# EAGLE design DMTV_v2 (EAGLE 9.6.2)
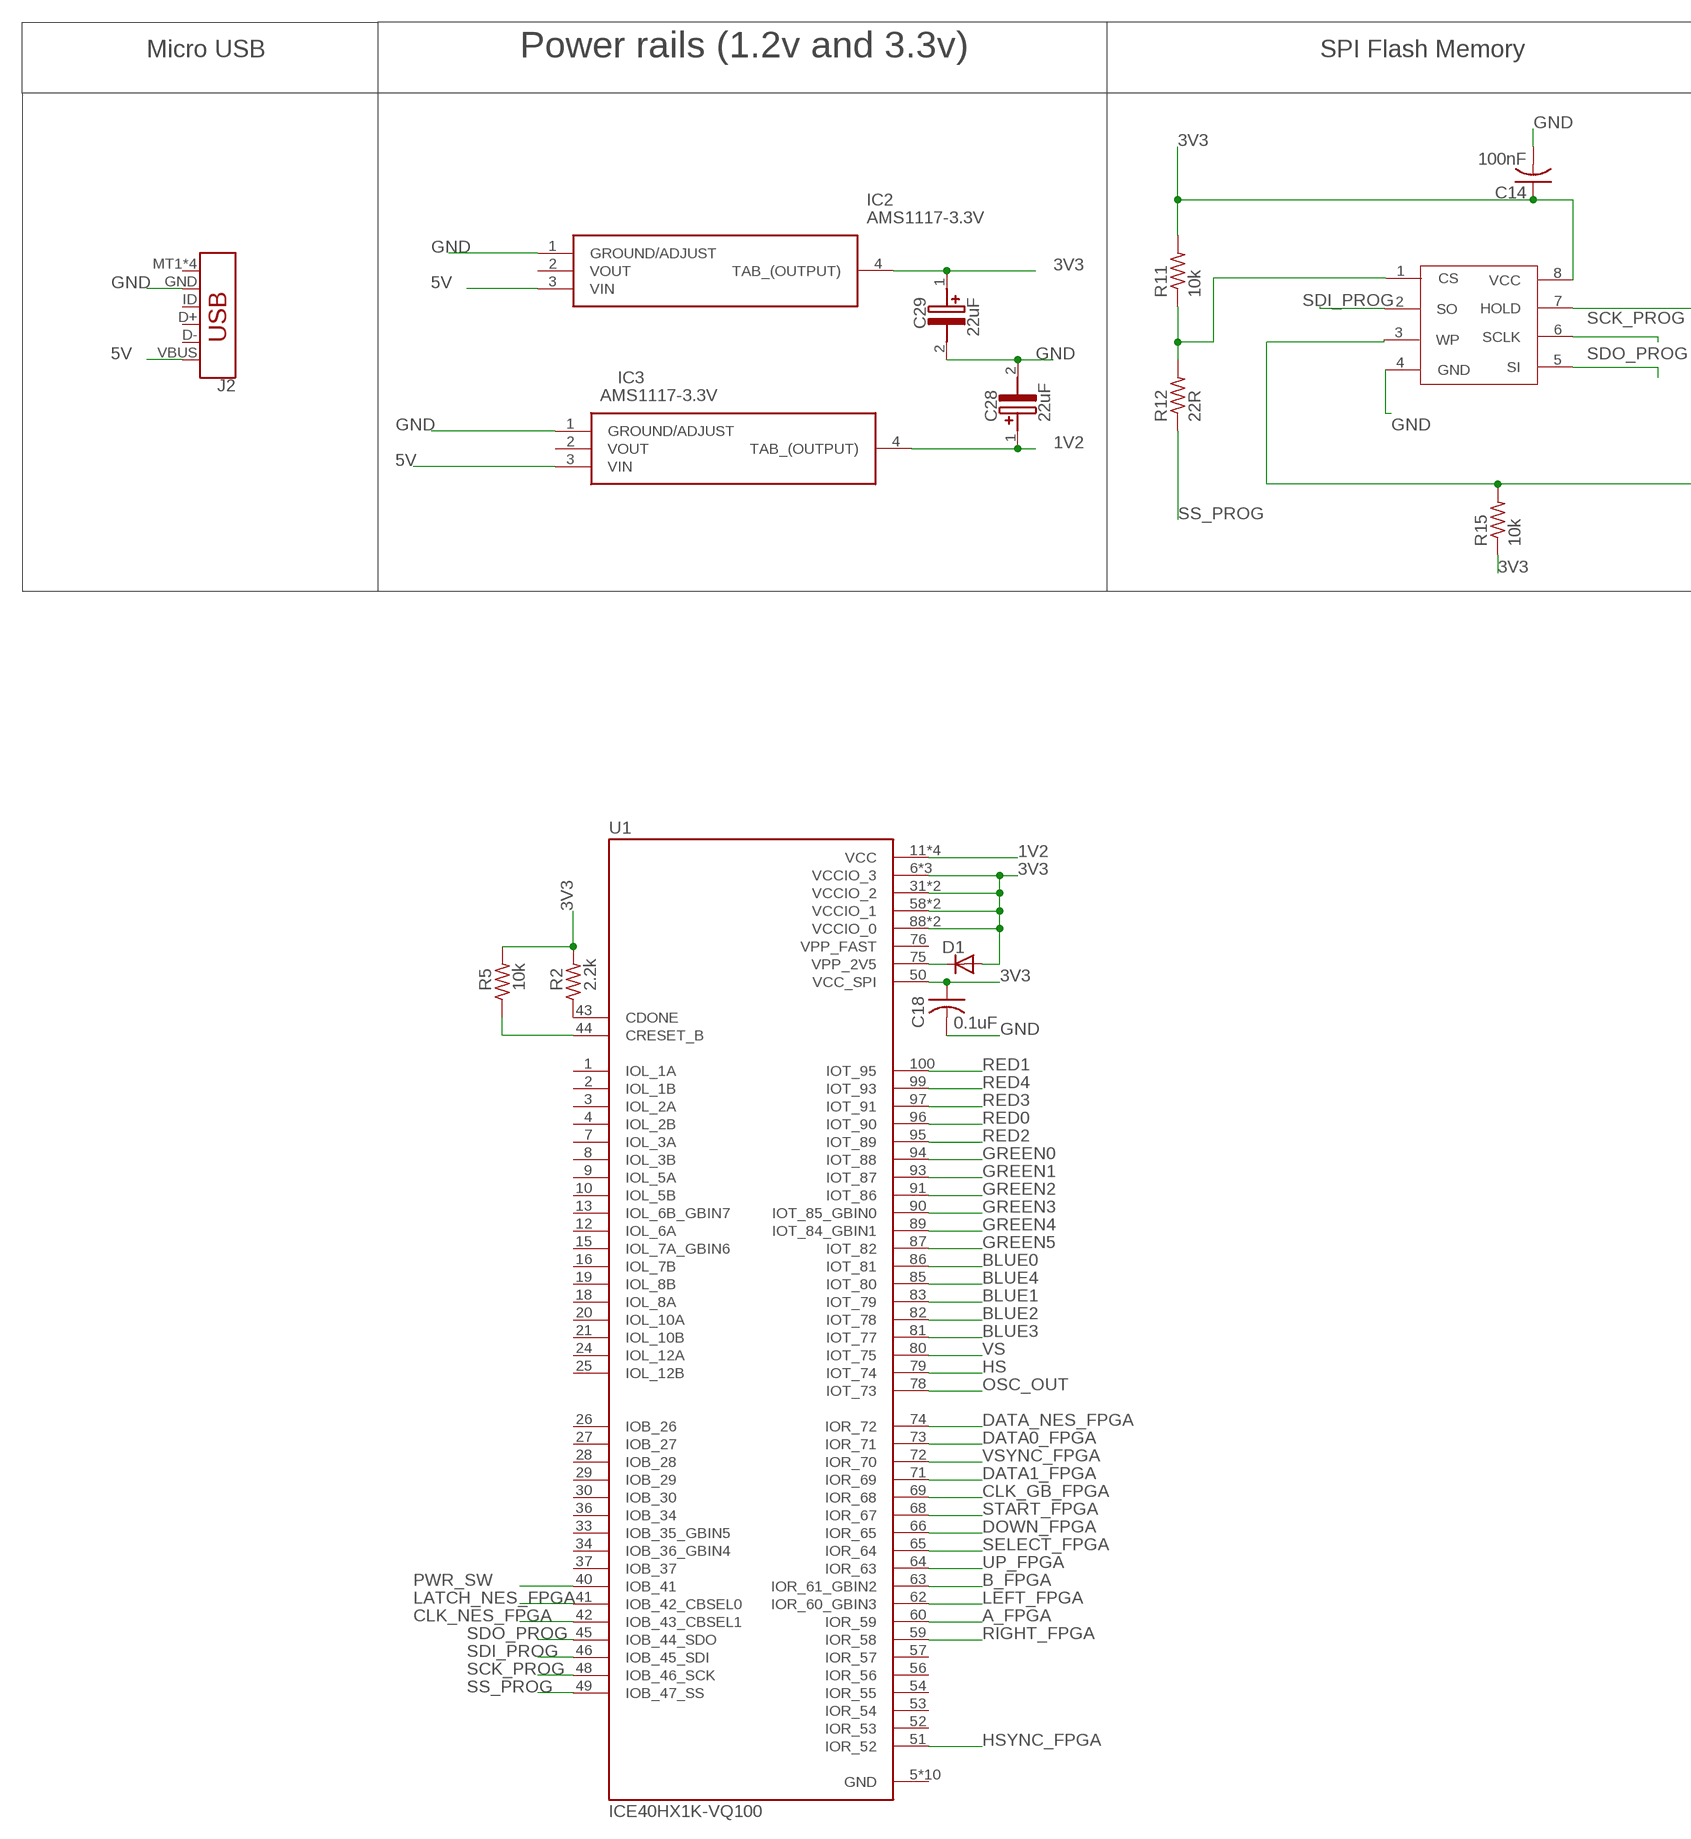
[diagram p0: schematic, sheet 1, part 1 of 2]
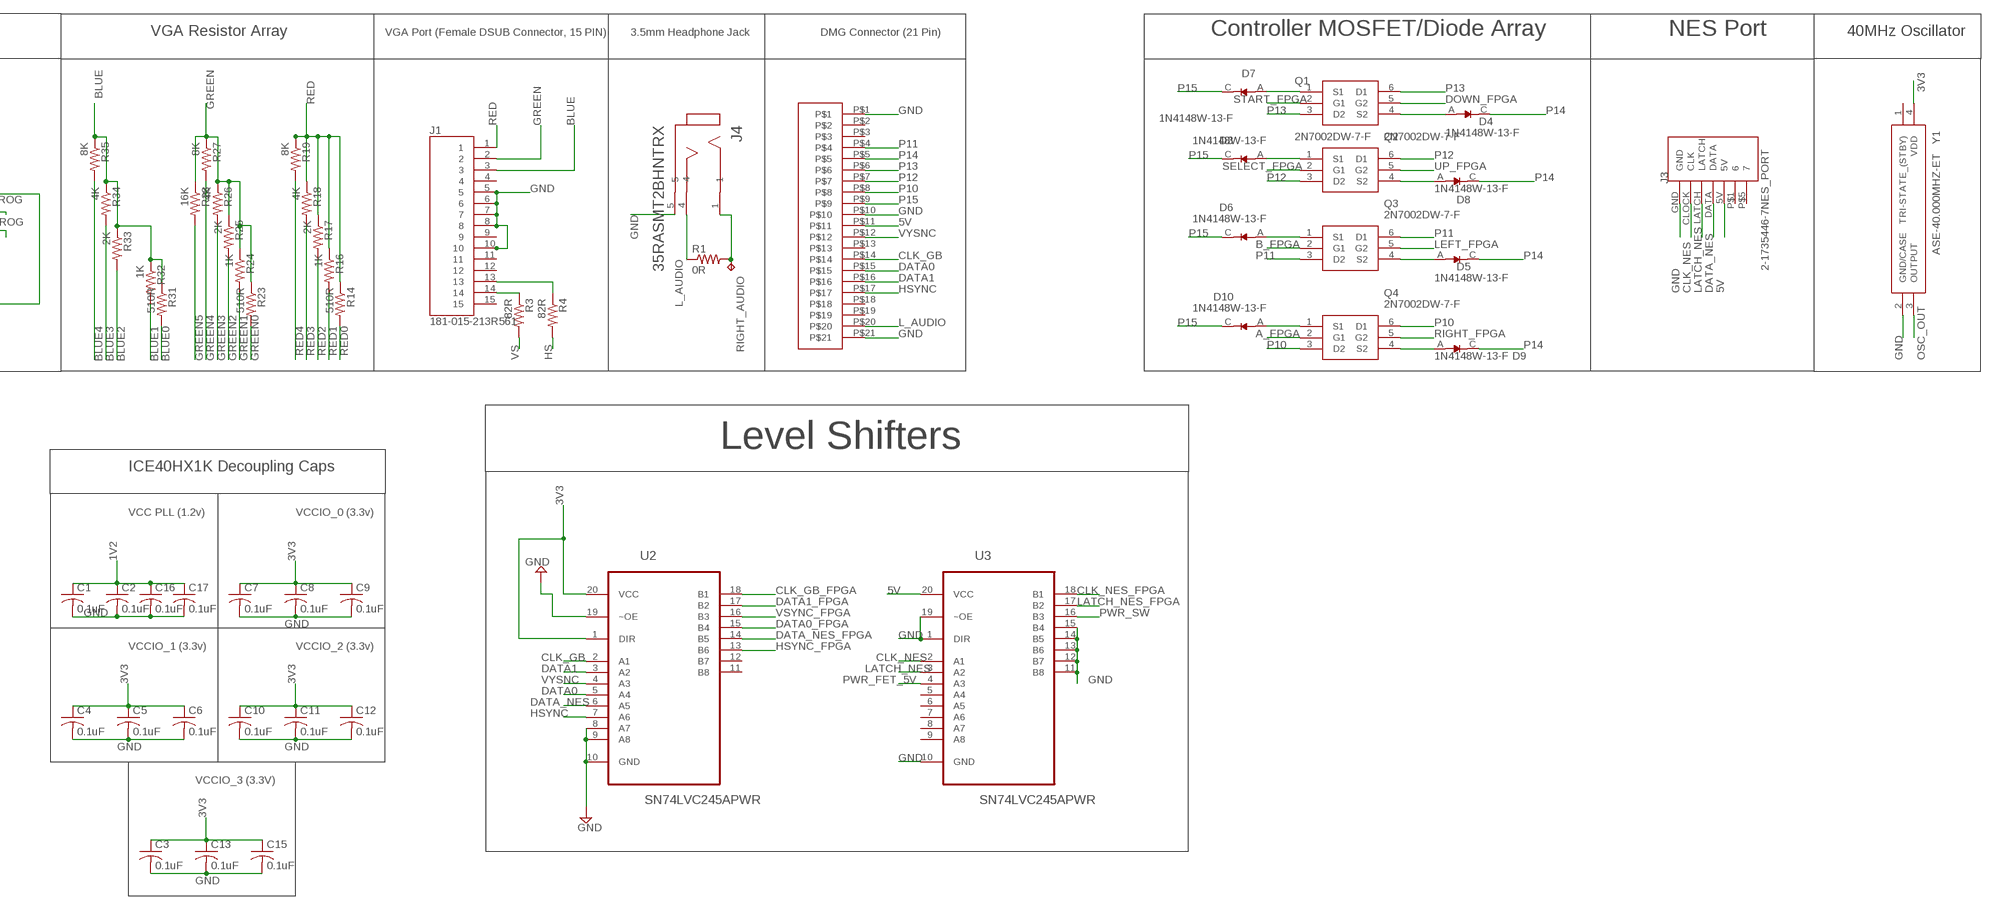
[diagram p1: schematic, sheet 1, part 2 of 2]

## Parts
C1  0.1uF  C-USC0603  [C0603]
C2  0.1uF  C-USC0603  [C0603]
C3  0.1uF  C-USC0603  [C0603]
C4  0.1uF  C-USC0603  [C0603]
C5  0.1uF  C-USC0603  [C0603]
C6  0.1uF  C-USC0603  [C0603]
C7  0.1uF  C-USC0603  [C0603]
C8  0.1uF  C-USC0603  [C0603]
C9  0.1uF  C-USC0603  [C0603]
C10  0.1uF  C-USC0603  [C0603]
C11  0.1uF  C-USC0603  [C0603]
C12  0.1uF  C-USC0603  [C0603]
C13  0.1uF  C-USC0603  [C0603]
C14  100nF  C-USC0603  [C0603]
C15  0.1uF  C-USC0603  [C0603]
C16  0.1uF  C-USC0603  [C0603]
C17  0.1uF  C-USC0603  [C0603]
C18  0.1uF  C-USC0603  [C0603]
C28  22uF  293D106X9016A2TE3  [CAPPM3216X180N]
C29  22uF  293D106X9016A2TE3  [CAPPM3216X180N]
D1  D-SOD123  [SOD123]
D3  1N4148W-13-F  [SOD3715X135N]
D4  1N4148W-13-F  [SOD3715X135N]
D5  1N4148W-13-F  [SOD3715X135N]
D6  1N4148W-13-F  [SOD3715X135N]
D7  1N4148W-13-F  [SOD3715X135N]
D8  1N4148W-13-F  [SOD3715X135N]
D9  1N4148W-13-F  [SOD3715X135N]
D10  1N4148W-13-F  [SOD3715X135N]
IC2  AMS1117-3.3V  [SOT229P700X180-4N]
IC3  AMS1117-3.3V  [SOT229P700X180-4N]
J1  181-015-213R561  [NORCOMP_181-015-213R561]
J2  USB_MICRO-B_SMT  [USB-MICROB]
J3  2-1735446-7NES_PORT  [NES_CONTROLLER_SOLDER_JACK]
J4  35RASMT2BHNTRX  [SWITCHCRAFT_35RASMT2BHNTRX]
Q1  2N7002DW-7-F  [SOT65P210X100-6N]
Q2  2N7002DW-7-F  [SOT65P210X100-6N]
Q3  2N7002DW-7-F  [SOT65P210X100-6N]
Q4  2N7002DW-7-F  [SOT65P210X100-6N]
R1  0R  R-US_R0603  [R0603]
R2  2.2k  R-US_R0603  [R0603]
R3  82R  R-US_R0603  [R0603]
R4  82R  R-US_R0603  [R0603]
R5  10k  R-US_R0603  [R0603]
R11  10k  R-US_R0603  [R0603]
R12  22R  R-US_R0603  [R0603]
R14  510R  R-US_R0603  [R0603]
R15  10k  R-US_R0603  [R0603]
R16  1K  R-US_R0603  [R0603]
R17  2K  R-US_R0603  [R0603]
R18  4K  R-US_R0603  [R0603]
R19  8K  R-US_R0603  [R0603]
R23  510R  R-US_R0603  [R0603]
R24  1K  R-US_R0603  [R0603]
R25  2K  R-US_R0603  [R0603]
R26  4K  R-US_R0603  [R0603]
R27  8K  R-US_R0603  [R0603]
R28  16K  R-US_R0603  [R0603]
R31  510R  R-US_R0603  [R0603]
R32  1K  R-US_R0603  [R0603]
R33  2K  R-US_R0603  [R0603]
R34  4K  R-US_R0603  [R0603]
R35  8K  R-US_R0603  [R0603]
RIGHT_AUDIO  TPB2,54  [B2,54]
U1  ICE40HX1K-VQ100  [QFP50P1600X1600X120-100N]
U2  SN74LVC245APWR  [SOP65P640X120-20N]
U3  SN74LVC245APWR  [SOP65P640X120-20N]
U$5  MX25L1006EMI-10G  [SOIC-8]
U$6  52808-21700520452145  [0520452145]
Y1  ASE-40.000MHZ-ET  [ASE40000MHZET]

## Nets
1V2: C1.1 C2.1 C16.1 C17.1 C28.1(+) IC3.4(TAB_(OUTPUT)) U1.11(VCC) U1.35(VCC) U1.61(VCC) U1.77(VCC)
3V3: C3.1 C4.1 C5.1 C6.1 C7.1 C8.1 C9.1 C10.1 C11.1 C12.1 C13.1 C14.1 C15.1 C18.1 C29.1(+) D1.2(A) IC2.4(TAB_(OUTPUT)) R2.2 R5.2 R11.2 R15.1 U1.6(VCCIO_3) U1.14(VCCIO_3) U1.22(VCCIO_3) U1.31(VCCIO_2) U1.38(VCCIO_2) U1.50(VCC_SPI) U1.58(VCCIO_1) U1.67(VCCIO_1) U1.88(VCCIO_0) U1.92(VCCIO_0) U2.1(DIR) U2.20(VCC) U$5.8(VCC) Y1.4(VDD)
5V: IC2.3(VIN) IC3.3(VIN) J2.VBUS J3.5V U3.20(VCC) U$6.P$11
A_FPGA: Q4.2(G1) U1.60(IOR_59)
B_FPGA: Q3.2(G1) U1.63(IOR_61_GBIN2)
BLUE: J1.3 R31.1 R32.1 R33.1 R34.1 R35.1
BLUE0: R31.2 U1.86(IOT_81)
BLUE1: R32.2 U1.83(IOT_79)
BLUE2: R33.2 U1.82(IOT_78)
BLUE3: R34.2 U1.81(IOT_77)
BLUE4: R35.2 U1.85(IOT_80)
CLK_GB: U2.2(A1) U$6.P$14
CLK_GB_FPGA: U1.69(IOR_68) U2.18(B1)
CLK_NES: J3.CLOCK(CLK) U3.2(A1)
CLK_NES_FPGA: U1.42(IOB_43_CBSEL1) U3.18(B1)
DATA0: U2.5(A4) U$6.P$15
DATA0_FPGA: U1.73(IOR_71) U2.15(B4)
DATA1: U2.3(A2) U$6.P$16
DATA1_FPGA: U1.71(IOR_69) U2.17(B2)
DATA_NES: J3.DATA U2.6(A5)
DATA_NES_FPGA: U1.74(IOR_72) U2.14(B5)
DOWN_FPGA: Q1.5(G2) U1.66(IOR_65)
GND: C1.2 C2.2 C3.2 C4.2 C5.2 C6.2 C7.2 C8.2 C9.2 C10.2 C11.2 C12.2 C13.2 C14.2 C15.2 C16.2 C17.2 C18.2 C28.2(-) C29.2(-) IC2.1(GROUND/ADJUST) IC3.1(GROUND/ADJUST) J1.5 J1.6 J1.7 J1.8 J1.10 J2.GND J3.GND J4.5 U2.8(A7) U2.9(A8) U2.10(GND) U2.19(~OE) U3.1(DIR) U3.10(GND) U3.11(B8) U3.12(B7) U3.13(B6) U3.14(B5) U3.15(B4) U3.19(~OE) U$5.4(GND) U$6.P$1 U$6.P$10 U$6.P$21 Y1.2(GND/CASE)
GREEN: J1.2 R23.1 R24.1 R25.1 R26.1 R27.1 R28.1
GREEN0: R23.2 U1.94(IOT_88)
GREEN1: R24.2 U1.93(IOT_87)
GREEN2: R25.2 U1.91(IOT_86)
GREEN3: R26.2 U1.90(IOT_85_GBIN0)
GREEN4: R27.2 U1.89(IOT_84_GBIN1)
GREEN5: R28.2 U1.87(IOT_82)
HS: R4.2 U1.79(IOT_74)
HSYNC: U2.7(A6) U$6.P$17
HSYNC_FPGA: U1.51(IOR_52) U2.13(B6)
L_AUDIO: J4.4 R1.1 U$6.P$20
LATCH_NES: J3.LATCH U3.3(A2)
LATCH_NES_FPGA: U1.41(IOB_42_CBSEL0) U3.17(B2)
LEFT_FPGA: Q3.5(G2) U1.62(IOR_60_GBIN3)
N$1: D1.1(C) U1.75(VPP_2V5)
N$2: D7.A Q1.1(S1)
N$3: J1.14 R3.1
N$4: J1.13 R4.1
N$5: J4.1 R1.2 RIGHT_AUDIO.TP
N$6: R2.1 U1.43(CDONE)
N$7: R5.1 U1.44(CRESET_B)
N$8: R11.1 R12.2 U$5.1(CS)
N$9: D4.A Q1.4(S2)
N$10: D3.A Q2.1(S1)
N$11: D8.A Q2.4(S2)
N$13: R15.2 U$5.3(WP) U$5.7(HOLD)
N$14: D5.A Q3.4(S2)
N$17: D9.A Q4.4(S2)
N$18: D10.A Q4.1(S1)
N$21: D6.A Q3.1(S1)
OSC_OUT: U1.78(IOT_73) Y1.3(OUTPUT)
P10: Q4.3(D2) Q4.6(D1) U$6.P$8
P11: Q3.3(D2) Q3.6(D1) U$6.P$4
P12: Q2.3(D2) Q2.6(D1) U$6.P$7
P13: Q1.3(D2) Q1.6(D1) U$6.P$6
P14: D4.C(K) D5.C(K) D8.C(K) D9.C(K) U$6.P$5
P15: D3.C(K) D6.C(K) D7.C(K) D10.C(K) U$6.P$9
PWR_FET_5V: U3.4(A3)
PWR_SW: U1.40(IOB_41) U3.16(B3)
RED: J1.1 R14.1 R16.1 R17.1 R18.1 R19.1
RED0: R14.2 U1.96(IOT_90)
RED1: R16.2 U1.100(IOT_95)
RED2: R17.2 U1.95(IOT_89)
RED3: R18.2 U1.97(IOT_91)
RED4: R19.2 U1.99(IOT_93)
RIGHT_FPGA: Q4.5(G2) U1.59(IOR_58)
SCK_PROG: U1.48(IOB_46_SCK) U$5.6(SCLK)
SDI_PROG: U1.46(IOB_45_SDI) U$5.2(SO)
SDO_PROG: U1.45(IOB_44_SDO) U$5.5(SI)
SELECT_FPGA: Q2.2(G1) U1.65(IOR_64)
SS_PROG: R12.1 U1.49(IOB_47_SS)
START_FPGA: Q1.2(G1) U1.68(IOR_67)
UP_FPGA: Q2.5(G2) U1.64(IOR_63)
VS: R3.2 U1.80(IOT_75)
VSYNC_FPGA: U1.72(IOR_70) U2.16(B3)
VYSNC: U2.4(A3) U$6.P$12
Unconnected: IC2.2(VOUT) IC3.2(VOUT) J1.4 J1.9 J1.11 J1.12 J1.15 J2.D+ J2.D- J2.ID J2.MT1(SHIELD) J2.MT2(SHIELD) J2.P$1(SHIELD) J2.P$2(SHIELD) J3.P$1 J3.P$5 U1.1(IOL_1A) U1.2(IOL_1B) U1.3(IOL_2A) U1.4(IOL_2B) U1.7(IOL_3A) U1.8(IOL_3B) U1.9(IOL_5A) U1.10(IOL_5B) U1.12(IOL_6A) U1.13(IOL_6B_GBIN7) U1.15(IOL_7A_GBIN6) U1.16(IOL_7B) U1.18(IOL_8A) U1.19(IOL_8B) U1.20(IOL_10A) U1.21(IOL_10B) U1.24(IOL_12A) U1.25(IOL_12B) U1.26(IOB_26) U1.27(IOB_27) U1.28(IOB_28) U1.29(IOB_29) U1.30(IOB_30) U1.33(IOB_35_GBIN5) U1.34(IOB_36_GBIN4) U1.36(IOB_34) U1.37(IOB_37) U1.52(IOR_53) U1.53(IOR_54) U1.54(IOR_55) U1.56(IOR_56) U1.57(IOR_57) U2.11(B8) U2.12(B7) U3.5(A4) U3.6(A5) U3.7(A6) U3.8(A7) U3.9(A8) U$6.P$2 U$6.P$3 U$6.P$13 U$6.P$18 U$6.P$19 Y1.1(TRI-STATE_(STBY))

## Notes on the sheet
- Micro USB | Power rails (1.2v and 3.3v) | SPI Flash Memory | VGA Resistor Array | VGA Port (Female DSUB Connector, 15 PIN) | 3.5mm Headphone Jack | DMG Connector (21 Pin) | Controller MOSFET/Diode Array | NES Port | 40MHz Oscillator
- Level Shifters
- ICE40HX1K Decoupling Caps
- VCC PLL (1.2v) | VCCIO_0 (3.3v)
- VCCIO_1 (3.3v) | VCCIO_2 (3.3v)
- VCCIO_3 (3.3V)

## Power pins joined to a net without a drawn wire
GND: U1.5(GND) U1.17(GND) U1.23(GND) U1.32(GND) U1.39(GND) U1.47(GND) U1.55(GND) U1.70(GND) U1.84(GND) U1.98(GND)
VPP_FAST: U1.76(VPP_FAST)

## Library data of the parts
C1-C18 = rcl:C-US: CAPACITOR, American symbol; SPICEPREFIX: C
C28 C29 = SamacSys_Parts:293D106X9016A2TE3: Capacitor Tantalum SMT 293D 16V 10uF Vishay 10uF SMD Solid MnO2 Tantalum Electrolytic Capacitor, 16 V dc +/-10%, 293D Series Source: Datasheet <https://componentsearchengine.com/Datasheets/1/293D106X9016A2TE3.pdf>; DESCRIPTION: Capacitor Tantalum SMT 293D 16V 10uF Vishay 10uF SMD Solid MnO2 Tantalum Electrolytic Capacitor, 16 V dc +/-10%, 293D Series; HEIGHT: 1.8mm; MANUFACTURER_NAME: Vishay; MANUFACTURER_PART_NUMBER: 293D106X9016A2TE3; MOUSER2_PART_NUMBER: 74-293D106X9016A2TE3; MOUSER2_PRICE-STOCK: https://www.mouser.com/Search/Refine.aspx?Keyword=74-293D106X9016A2TE3
D1 = semicon-smd-ipc:D-: DIODE unfilled
D3-D10 = 1N4148W-13-F:1N4148W-13-F: 1N4148W Series 2 A 100 V 400 mW Surface Mount Fast Switching Diode - SOD-123; AVAILABILITY: Unavailable; DESCRIPTION: Diode Standard 100V 150mA Surface Mount SOD-123; MF: Diodes Inc.; MP: 1N4148W-13-F; PACKAGE: SOD-123 Diodes Inc.; PRICE: None
IC2 IC3 = SamacSys_Parts:AMS1117-3.3V: 1A LOW DROPOUT VOLTAGE REGULATOR, SOT-223 Source: Datasheet <http://www.advanced-monolithic.com/pdf/ds1117.pdf>; DESCRIPTION: 1A LOW DROPOUT VOLTAGE REGULATOR, SOT-223; HEIGHT: 1.8mm; MANUFACTURER_NAME: Advanced Monolithic Systems; MANUFACTURER_PART_NUMBER: ams1117-3.3v
J1 = 181-015-213R561:181-015-213R561: 181 Series 15 Position Female Receptacle Right Angle D-Sub Connector; AVAILABILITY: Unavailable; DESCRIPTION: 181 Series 15 Position Female Receptacle Right Angle D-Sub Connector; MF: NorComp Inc.; MP: 181-015-213R561; PACKAGE: None; PRICE: None
J2 = 2x3PostStyle:USB_MICRO-B: USB Type Micro-B Connector Male/female and PTH/SMT variants SparkFun Products: SparkFun microB USB Breakout <https://www.sparkfun.com/products/12035> SparkFun USB microB Plug Breakout <https://www.sparkfun.com/products/10031> SparkFun ESP8266 Thing <https://www.sparkfun.com/products/13231>; PROD_ID: CONN-09505; SF_ID: PRT-08533
J3 = NES_CONTROLLER_FEMALE_SOCKET:2-1735446-7
J4 = 35RASMT2BHNTRX_3.5mmJack:35RASMT2BHNTRX: Conn 3.5MM Stereo Jack F 3 POS Solder RA SMD 3 Terminal 1 Port T/R; AVAILABILITY: Unavailable; DESCRIPTION: Conn 3.5MM Stereo Jack F 3 POS Solder RA SMD 3 Terminal 1 Port T/R; MF: Switchcraft; MP: 35RASMT2BHNTRX; PACKAGE: None; PRICE: None
Q1-Q4 = SamacSys_Parts:2N7002DW-7-F: Diodes Inc 2N7002DW-7-F Dual N-channel MOSFET, 115 mA, 60 V, 6-Pin SOT-363 Source: Datasheet <https://componentsearchengine.com/Datasheets/1/2N7002DW-7-F.pdf>; DESCRIPTION: Diodes Inc 2N7002DW-7-F Dual N-channel MOSFET, 115 mA, 60 V, 6-Pin SOT-363; HEIGHT: 1mm; MANUFACTURER_NAME: Diodes Inc.; MANUFACTURER_PART_NUMBER: 2N7002DW-7-F; MOUSER2_PART_NUMBER: 621-2N7002DW-F; MOUSER2_PRICE-STOCK: https://www.mouser.com/Search/Refine.aspx?Keyword=621-2N7002DW-F
R1 R2 R5 R11 R12 R15 = rcl:R-US_: RESISTOR, American symbol; SPICEPREFIX: R
R3 R4 R14 R16-R19 R23-R28 R31-R35 = resistor:R-US_: RESISTOR, American symbol
RIGHT_AUDIO = testpad:TP: Test pad
U1 = ICE40HX1K-VQ100:ICE40HX1K-VQ100: HX Series 1280 LUTs 95 I/O 64 kBit RAM 1.2 V Surface Mount FPGA - VQFP-100; DESCRIPTION: HX Series 1280 LUTs 95 I/O 64 kBit RAM 1.2 V Surface Mount FPGA - VQFP-100; DIGI-KEY_PART_NUMBER: 220-1567-ND; DIGI-KEY_PURCHASE_URL: https://www.digikey.com/product-detail/en/lattice-semiconductor-corporation/ICE40HX1K-VQ100/220-1567-ND/3083577?utm_source=snapeda&utm_medium=aggregator&utm_campaign=symbol; MF: Lattice Semiconductor; MP: ICE40HX1K-VQ100; PACKAGE: TQFP-100 Lattice Semiconductor
U2 U3 = SN74LVC245APWR:SN74LVC245APWR: OCTAL BUS TRANSCEIVER WITH 3-STATE OUTPUTS; DESCRIPTION: Octal Bus Transceiver With 3-State Outputs 20-TSSOP -40 to 125; DIGI-KEY_PART_NUMBER: 296-1233-1-ND; DIGI-KEY_PURCHASE_URL: https://www.digikey.com/product-detail/en/texas-instruments/SN74LVC245APWR/296-1233-1-ND/276501?utm_source=snapeda&utm_medium=aggregator&utm_campaign=symbol; MF: Texas Instruments; MP: SN74LVC245APWR; PACKAGE: TSSOP-20 Texas Instruments
U$5 = MX25L1006EMI-10G:MX25L1006EMI-10G
U$6 = 0520452145:52808-2170
Y1 = SamacSys_Parts:ASE-40.000MHZ-ET: Standard Clock Oscillators XTAL OSC XO 40.0000MHZ CMOS SMD Source: Datasheet; DESCRIPTION: Standard Clock Oscillators XTAL OSC XO 40.0000MHZ CMOS SMD; HEIGHT: 1.2mm; MANUFACTURER_NAME: ABRACON; MANUFACTURER_PART_NUMBER: ASE-40.000MHZ-ET; MOUSER_PART_NUMBER: 815-ASE40.000MHZET; MOUSER_PRICE-STOCK: https://www.mouser.co.uk/ProductDetail/ABRACON/ASE-40000MHZ-ET?qs=uDmhV2jwPRdWFD1uCzXItQ%3D%3D

## Board
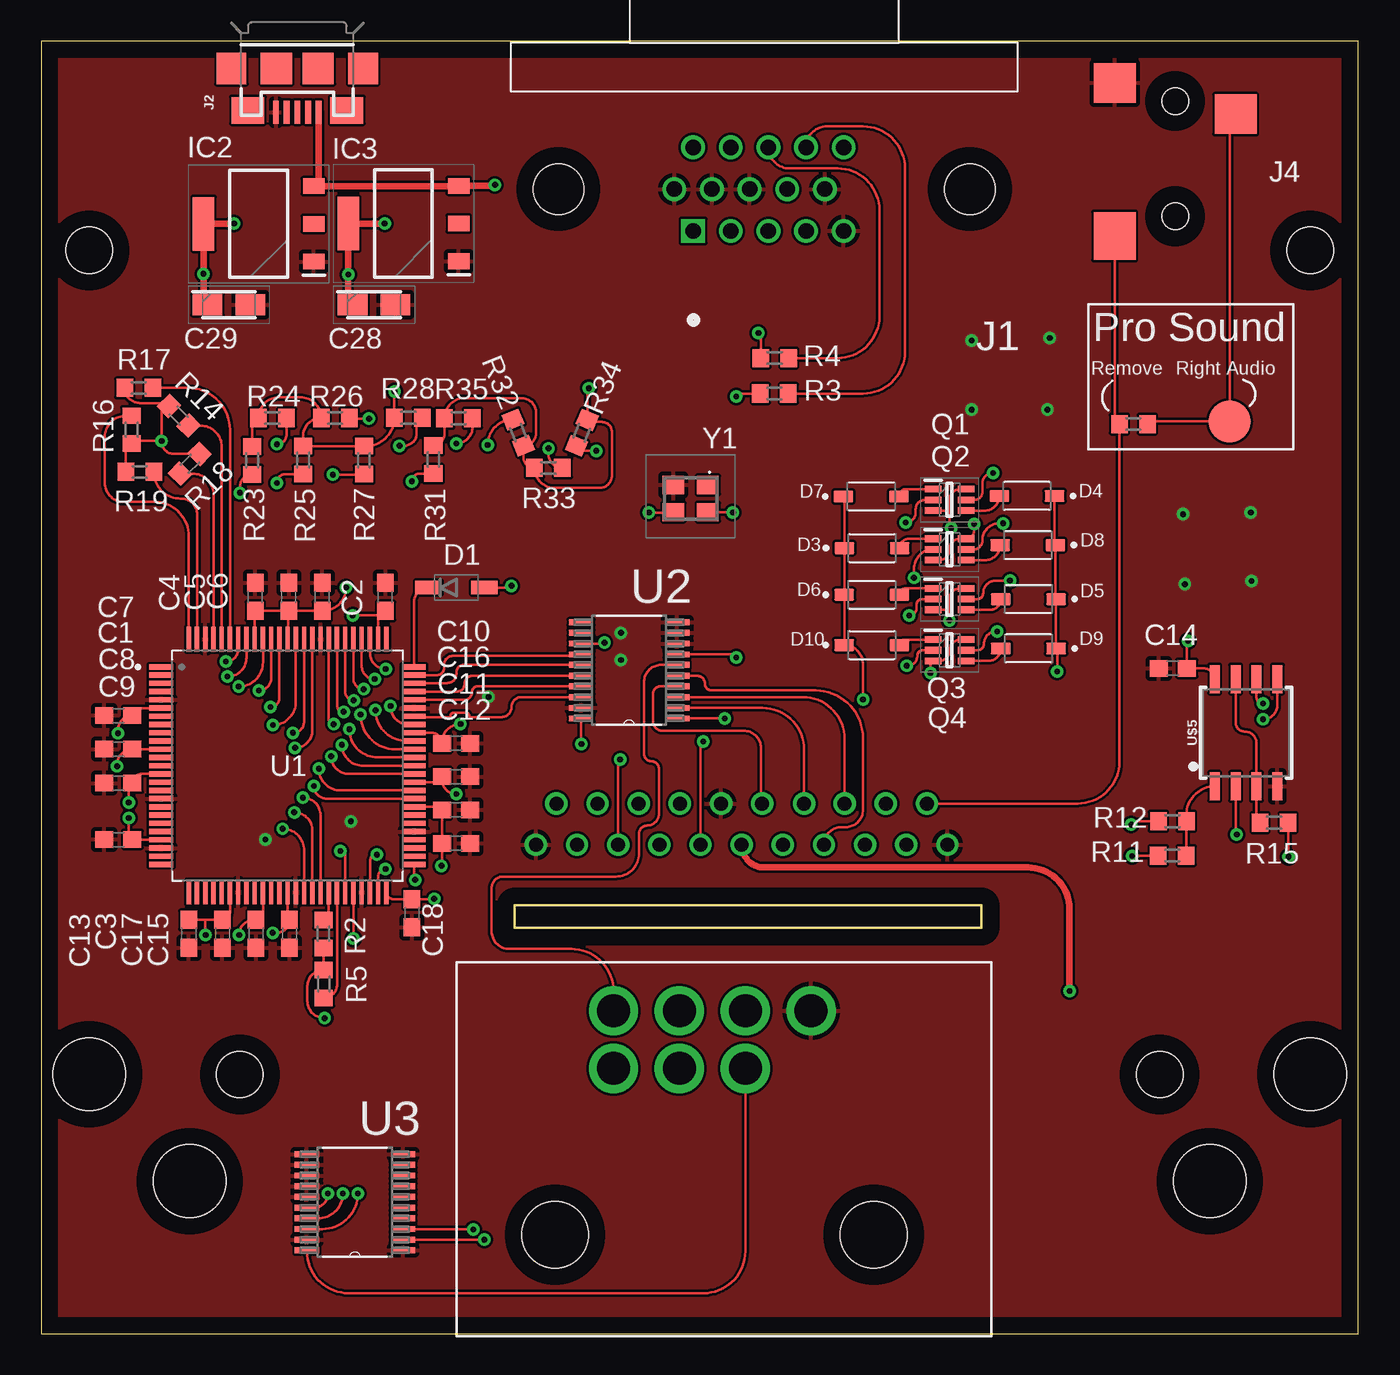
[diagram p2: board, top side]
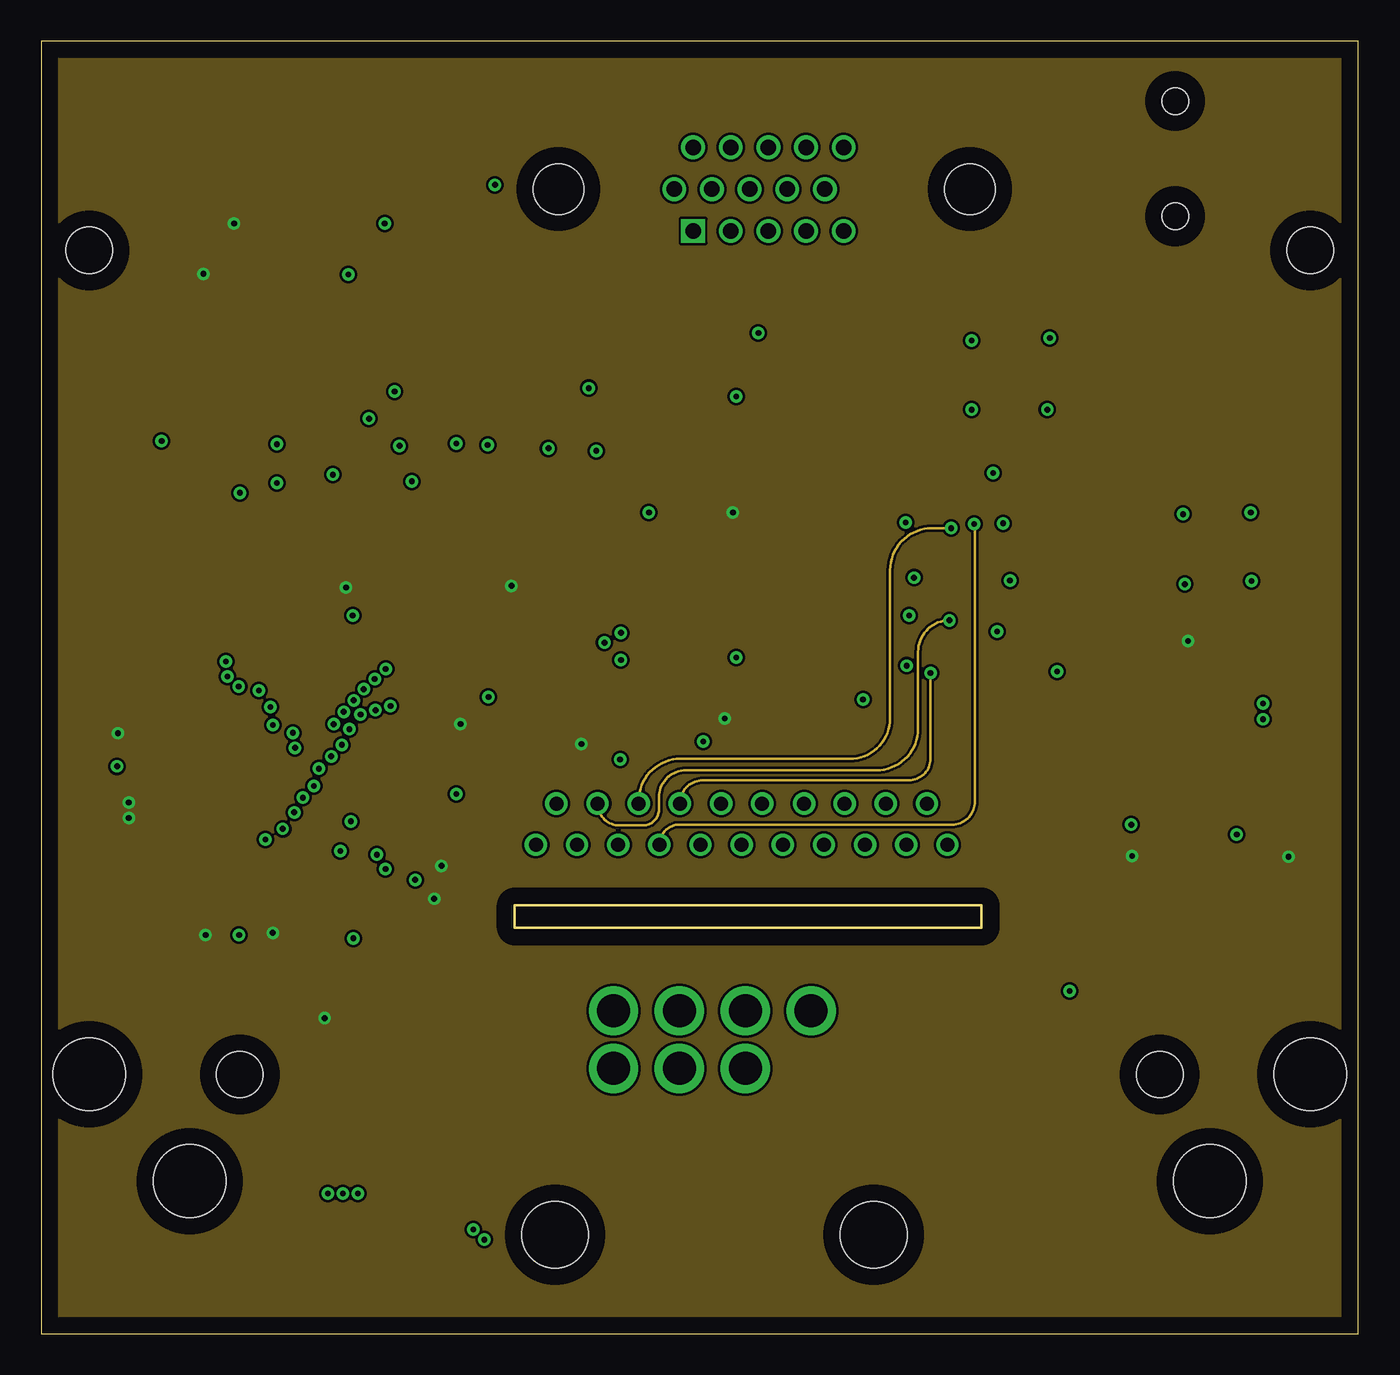
[diagram p3: board, inner layer Route2]
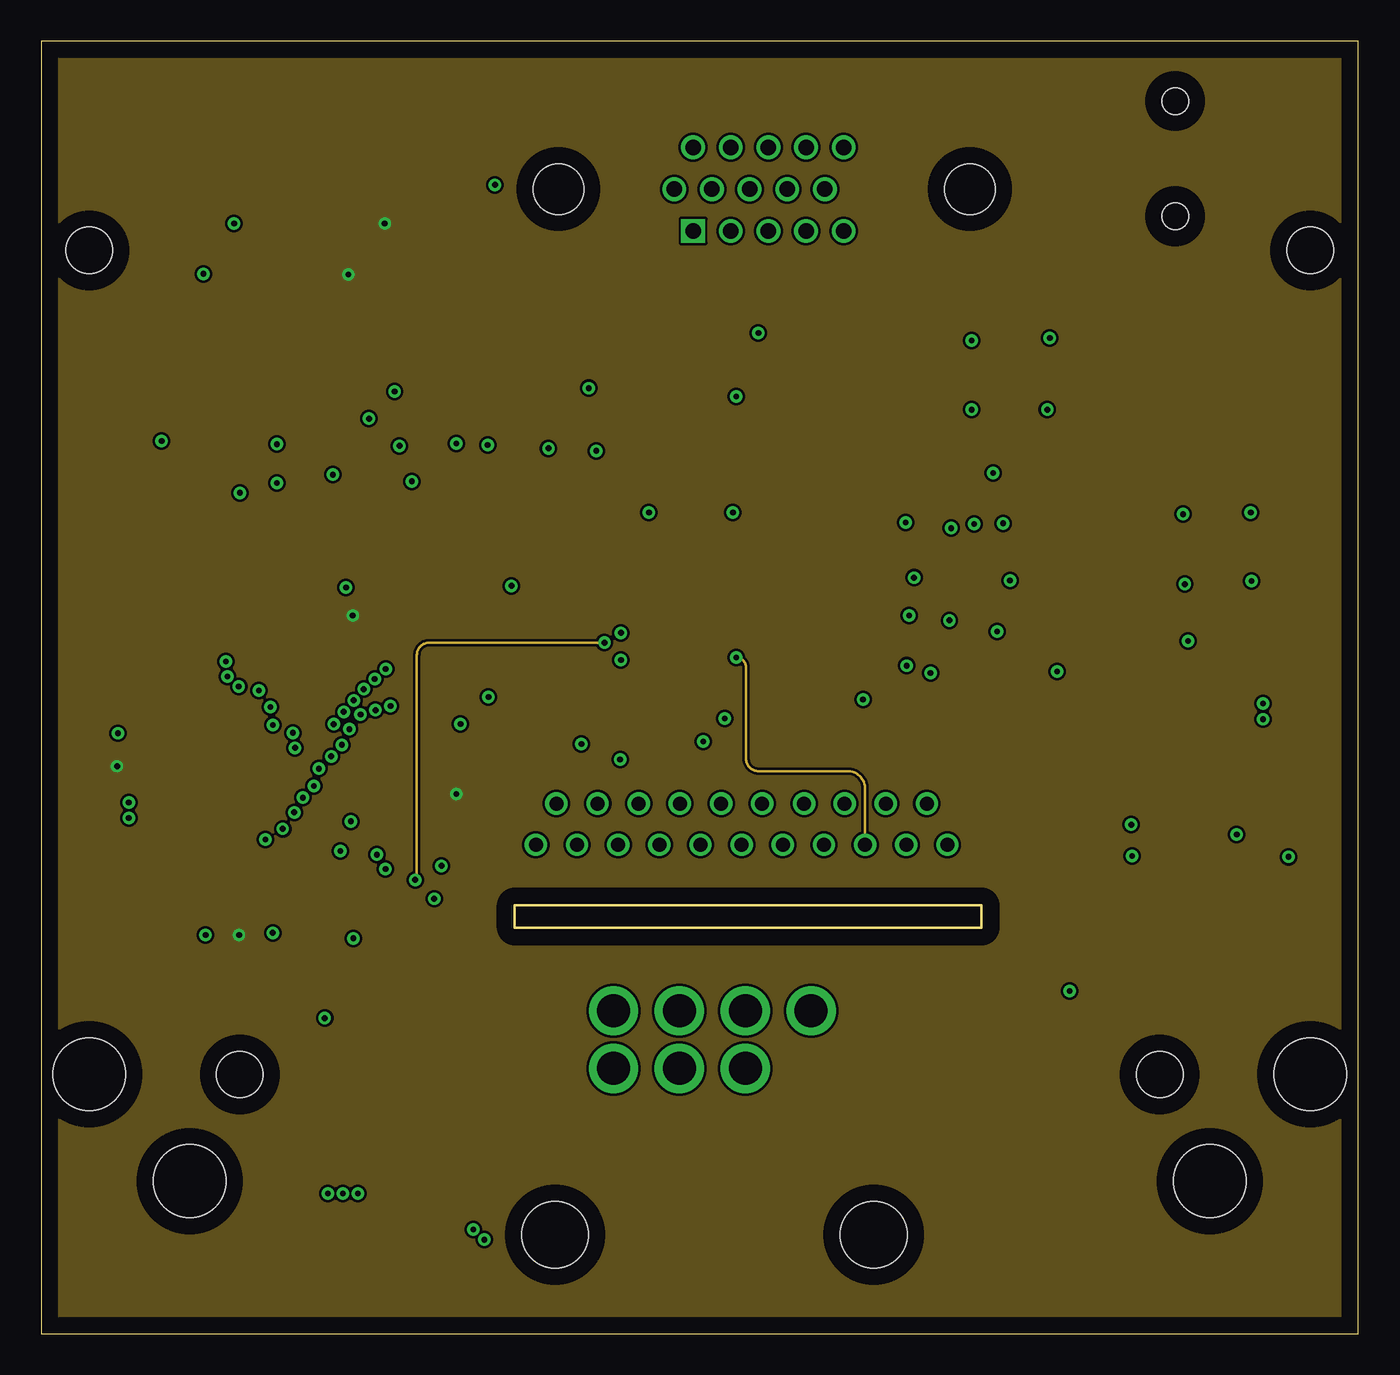
[diagram p4: board, inner layer Route15]
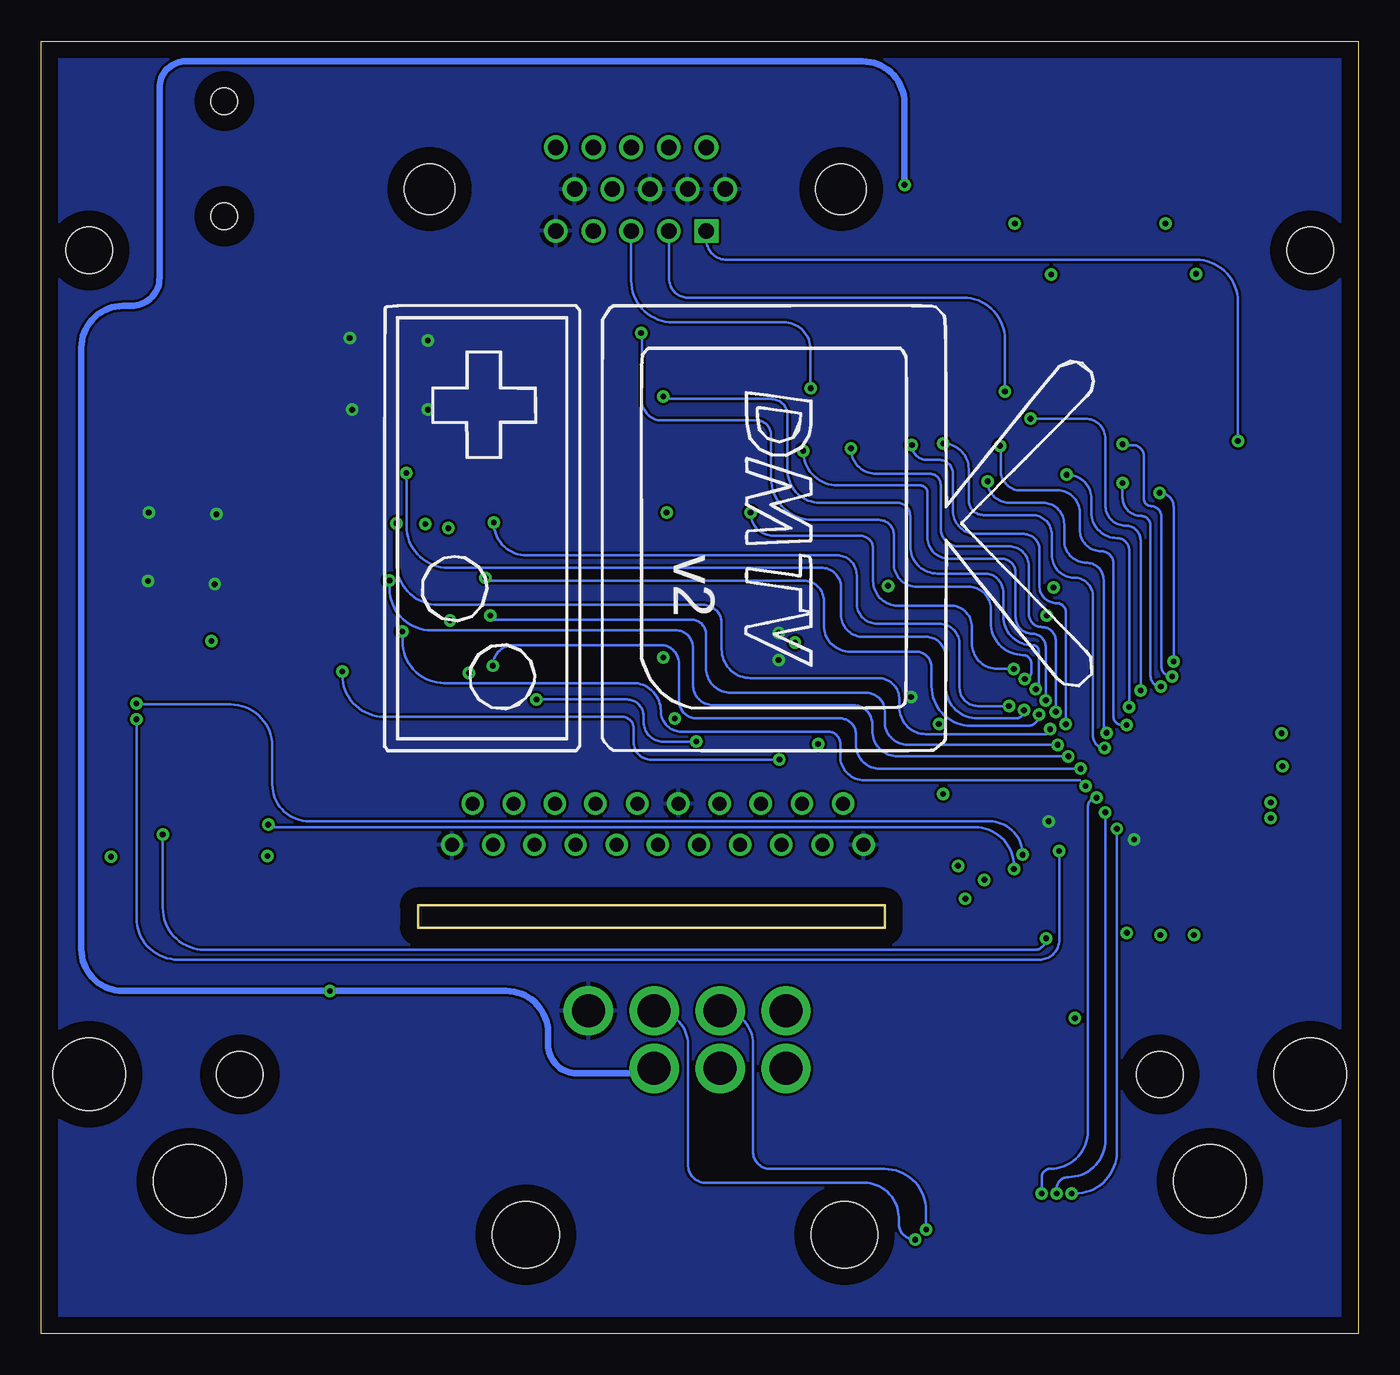
[diagram p5: board, bottom side, seen from below]

Size 80.01 x 78.49 mm. Coordinates in mm from the lower left corner, seen from the top.
Outline: 0,0 80.01,0 80.01,78.49 0,78.49 0,0
Outline: 28.77,26.01 57.12,26.01 57.12,24.66 28.77,24.66 28.77,26.01
Copper layers (1+2*15+16): Top 0.035mm / dielectric 10mil / Route2 0.035mm / dielectric 40mil / Route15 0.035mm / dielectric 10mil / Bottom 0.035mm
Design rules "default *": minimum track width 6mil, minimum drill 0.35mm, track to track 6mil, track to pad 6mil, pad to pad 6mil, via to via 6mil, smd to smd 6mil, copper to edge 40mil, drill to drill 6mil, minimum pad ring 10mil, minimum via ring 8mil, stop-mask expansion 4mil, vias tented up to drill 36mil, thermal gap 10mil
Holes 2.8 mm at 2.92,65.79 77.09,65.79 12.07,15.75 67.94,15.75
Holes 4.41 mm at 9.02,9.27 70.99,9.27 2.92,15.75 77.09,15.75

### Footprints (pad centres in the part's own frame; a part is rotated, then mirrored left to right if it is on the bottom)
C0603 = smd 1.1 x 1: 1 -0.85,0; 2 0.85,0
CAPPM3216X180N = smd 1.8 x 1.25: 1 -1.3,0; 2 1.3,0
SOD123 = smd 1.6 x 0.8: 1 -1.7,0; 2 1.7,0
SOD3715X135N = smd 1.21 x 0.73: A 1.68,0; C -1.68,0
SOT229P700X180-4N = smd 1.3 x 0.95: 1 -3.35,2.29; 2 -3.35,0; 3 -3.35,-2.29 | smd 1.3 x 3.25: 4 3.35,0
NORCOMP_181-015-213R561 = drill 0.94 square: 1 4.318,2.54 | drill 0.94: 2 2.032,2.54; 3 -0.254,2.54; 4 -2.54,2.54; 5 -4.826,2.54; 6 5.461,0; 7 3.175,0; 8 0.889,0; 9 -1.397,0; 10 -3.683,0; 11 4.318,-2.54; 12 2.032,-2.54; 13 -0.254,-2.54; 14 -2.54,-2.54; 15 -4.826,-2.54 | hole 3.048: 12.497,0; -12.497,0
USB-MICROB = smd 1.4 x 0.35: D+ -2.65,0; D- -2.65,-0.65; GND -2.65,1.3; ID -2.65,0.65; VBUS -2.65,-1.3 | smd 1.9 x 1.8: MT1 0,-4; MT2 0,4 | smd 1.9 x 1.9: P$1 0,-1.27; P$2 0,1.27 | smd 1.6 x 2: P$3 -2.55,-3; P$4 -2.55,3
NES_CONTROLLER_SOLDER_JACK = drill 2 pad 2.5: 5V 8,0; CLOCK 8,3.5; DATA 0,3.5; GND 12,3.5; LATCH 4,3.5; P$1 0,0; P$5 4,0 | hole 4.05: -3.55,-10.1; 15.8,-10.1
SWITCHCRAFT_35RASMT2BHNTRX = smd 2.4 x 2.55: 1 -2.7,3.675; 5 -4.6,-3.675 | smd 2.9 x 2.55: 4 4.7,-3.675 | hole 1.6: -3.5,0; 3.5,0
SOT65P210X100-6N = smd 1 x 0.4: 1 -1,0.65; 2 -1,0; 3 -1,-0.65; 4 1,-0.65; 5 1,0; 6 1,0.65
R0603 = smd 1 x 1.1: 1 -0.85,0; 2 0.85,0
B2,54 = smd 2.54 x 2.54: TP 0,0
QFP50P1600X1600X120-100N = smd 1.47 x 0.28: 1 -7.67,6; 2 -7.67,5.5; 3 -7.67,5; 4 -7.67,4.5; 5 -7.67,4; 6 -7.67,3.5; 7 -7.67,3; 8 -7.67,2.5; 9 -7.67,2; 10 -7.67,1.5; 11 -7.67,1; 12 -7.67,0.5; 13 -7.67,0; 14 -7.67,-0.5; 15 -7.67,-1; 16 -7.67,-1.5; 17 -7.67,-2; 18 -7.67,-2.5; 19 -7.67,-3; 20 -7.67,-3.5; 21 -7.67,-4; 22 -7.67,-4.5; 23 -7.67,-5; 24 -7.67,-5.5; 25 -7.67,-6; 51 7.67,-6; 52 7.67,-5.5; 53 7.67,-5; 54 7.67,-4.5; 55 7.67,-4; 56 7.67,-3.5; 57 7.67,-3; 58 7.67,-2.5; 59 7.67,-2; 60 7.67,-1.5; 61 7.67,-1; 62 7.67,-0.5; 63 7.67,0; 64 7.67,0.5; 65 7.67,1; 66 7.67,1.5; 67 7.67,2; 68 7.67,2.5; 69 7.67,3; 70 7.67,3.5; 71 7.67,4; 72 7.67,4.5; 73 7.67,5; 74 7.67,5.5; 75 7.67,6 | smd 0.28 x 1.47: 26 -6,-7.67; 27 -5.5,-7.67; 28 -5,-7.67; 29 -4.5,-7.67; 30 -4,-7.67; 31 -3.5,-7.67; 32 -3,-7.67; 33 -2.5,-7.67; 34 -2,-7.67; 35 -1.5,-7.67; 36 -1,-7.67; 37 -0.5,-7.67; 38 0,-7.67; 39 0.5,-7.67; 40 1,-7.67; 41 1.5,-7.67; 42 2,-7.67; 43 2.5,-7.67; 44 3,-7.67; 45 3.5,-7.67; 46 4,-7.67; 47 4.5,-7.67; 48 5,-7.67; 49 5.5,-7.67; 50 6,-7.67; 76 6,7.67; 77 5.5,7.67; 78 5,7.67; 79 4.5,7.67; 80 4,7.67; 81 3.5,7.67; 82 3,7.67; 83 2.5,7.67; 84 2,7.67; 85 1.5,7.67; 86 1,7.67; 87 0.5,7.67; 88 0,7.67; 89 -0.5,7.67; 90 -1,7.67; 91 -1.5,7.67; 92 -2,7.67; 93 -2.5,7.67; 94 -3,7.67; 95 -3.5,7.67; 96 -4,7.67; 97 -4.5,7.67; 98 -5,7.67; 99 -5.5,7.67; 100 -6,7.67
SOP65P640X120-20N = smd 1.473 x 0.356: 1 -2.921,2.921; 2 -2.921,2.286; 3 -2.921,1.626; 4 -2.921,0.965; 5 -2.921,0.33; 6 -2.921,-0.33; 7 -2.921,-0.965; 8 -2.921,-1.626; 9 -2.921,-2.286; 10 -2.921,-2.921; 11 2.921,-2.921; 12 2.921,-2.286; 13 2.921,-1.626; 14 2.921,-0.965; 15 2.921,-0.33; 16 2.921,0.33; 17 2.921,0.965; 18 2.921,1.626; 19 2.921,2.286; 20 2.921,2.921
SOIC-8 = smd 0.61 x 1.702: 1 -1.905,-3.251; 2 -0.635,-3.251; 3 0.635,-3.251; 4 1.905,-3.251; 5 1.905,3.251; 6 0.635,3.251; 7 -0.635,3.251; 8 -1.905,3.251
0520452145 = drill 0.85: P$1 0,0; P$2 1.25,2.5; P$3 2.5,0; P$4 3.75,2.5; P$5 5,0; P$6 6.25,2.5; P$7 7.5,0; P$8 8.75,2.5; P$9 10,0; P$10 11.25,2.5; P$11 12.5,0; P$12 13.75,2.5; P$13 15,0; P$14 16.3,2.5; P$15 17.5,0; P$16 18.75,2.5; P$17 20,0; P$18 21.25,2.5; P$19 22.5,0; P$20 23.75,2.5; P$21 25,0
ASE40000MHZET = smd 1.3 x 1.1: 1 -1.05,-0.825; 2 1.05,-0.825; 3 1.05,0.825; 4 -1.05,0.825

### Placement (x,y rotation side)
C1  4.69,35.49 180 top
C2  20.91,44.74 90 top
C3  11.01,24.28 270 top
C4  13.01,44.74 90 top
C5  15.05,44.74 90 top
C6  17.08,44.74 90 top
C7  4.69,37.54 180 top
C8  4.69,33.43 180 top
C9  4.69,30.01 180 top
C10  25.2,35.84 0 top
C11  25.2,31.8 0 top
C12  25.2,29.77 0 top
C13  8.97,24.28 270 top
C14  68.74,40.4 180 top
C15  15.09,24.28 270 top
C16  25.2,33.82 0 top
C17  13.05,24.28 270 top
C18  22.52,25.53 270 top
C28  20.22,62.48 0 top
C29  11.4,62.48 0 top
D1  25.22,45.31 0 top
D3  50.47,47.7 0 top
D4  59.88,50.87 180 top
D5  59.97,44.6 180 top
D6  50.46,44.87 0 top
D7  50.42,50.84 0 top
D8  59.93,47.88 180 top
D9  59.97,41.61 180 top
D10  50.46,41.81 0 top
IC2  13.21,67.39 180 top
IC3  22.01,67.41 180 top
J1  43.92,69.5 180 top
J2  15.56,76.83 90 top
J3  34.77,16.11 0 top
J4  68.88,71.35 270 top
Q1  55.18,50.63 0 top
Q2  55.18,47.62 0 top
Q3  55.18,44.61 0 top
Q4  55.18,41.5 0 top
R1  66.35,55.23 0 top
R2  17.15,24.28 270 top
R3  44.54,57.09 180 top
R4  44.56,59.24 180 top
R5  17.17,21.24 90 top
R11  68.71,29.03 180 top
R12  68.72,31.12 0 top
R14  8.36,55.74 315 top
R15  74.89,31.03 180 top
R16  5.5,54.89 90 top
R17  5.93,57.43 0 top
R18  9.03,52.82 225 top
R19  5.99,52.33 0 top
R23  12.82,53.03 270 top
R24  14.05,55.6 0 top
R25  15.91,53.05 270 top
R26  17.86,55.6 0 top
R27  19.61,53.04 270 top
R28  22.3,55.62 0 top
R31  23.82,53.08 270 top
R32  28.97,54.72 112 top
R33  30.81,52.57 0 top
R34  32.84,54.7 247 top
R35  25.35,55.59 0 top
RIGHT_AUDIO  72.2,55.39 0 top
U1  14.97,34.49 0 top
U2  35.71,40.28 180 top
U3  19.06,7.98 180 top
U$1  [DMTVPLS]  59.22,62.51 270 bottom
U$5  73.19,36.49 0 top
U$6  30.05,29.69 0 top
Y1  39.45,50.71 180 top

### Tracks (layer width: path | path; a pad name or v marks a point on that pad's centre or on a via)
1V2  (via drill 0.35)
  Top 0.152: U1.11 C1.1 arc90 4.61,34.57 v4.61,34.46 | U1.61 24.02,33.49 arc90 C16.1 24.35,33.63 arc90 v25.21,32.77 | U1.35 13.47,25.55 arc-90 C17.1 12.94,25.13 arc90 v12.03,24.22 | U1.77 20.47,43.45 arc-90 C2.1 arc-90 20.63,43.61 v18.93,43.61
  Top 0.406: v20.87,67.41 IC3.4 v18.66,64.31 18.66,64.11 18.66,62.74 arc90 C28.1
  pour Route15: -2.73,88.76 84.92,88.76 84.92,-4.94 -2.73,-4.94
3V3  (via drill 0.35)
  Top 0.152: R2.2 17.15,22.11 arc90 R5.2 arc90 16.17,21.09 16.17,20.21 arc90 v17.22,19.16 | U1.22 5.56,29.99 arc-90 C9.1 arc-90 5.32,30.23 v5.32,31.31 | U1.14 6.1,33.99 arc90 C8.1 arc90 5.32,33.21 v5.32,32.26 | U1.6 5.99,37.99 arc90 C7.1 arc90 4.67,36.67 v4.67,36.46 | C5.1 15,43.84 15,42.24 14.97,42.21 arc-90 U1.88 | U1.92 12.97,43.85 arc-90 C4.1 C5.1 | C5.1 C6.1 17.1,43.89 arc90 v18.52,45.31 | U1.67 23.7,36.49 arc-90 C10.1 24.35,35.9 arc-90 v25.47,37.02 | U1.58 24.16,31.99 arc-90 C11.1 C12.1 24.35,28.44 arc-90 v24.32,28.41 | U1.50 arc90 21.41,26.38 C18.1 23.84,26.38 v23.87,26.41 | U1.38 14.97,25.25 arc90 C15.1 arc-90 14.3,24.34 v14.06,24.34 | U1.31 11.47,25.59 arc-90 C3.1 9.97,25.13 | 9.97,25.13 C13.1 | 9.97,25.13 9.97,24.23 arc90 v9.99,24.21 | Y1.4 41.99,49.89 arc-90 v42.02,49.86 | U$5.8 arc90 70.63,40.4 C14.1 69.59,41.98 arc-90 v69.67,42.06 | R11.2 66.29,29.03 arc90 v66.27,29.01 | R15.1 75.74,28.99 arc90 v75.77,28.96 | U2.20 32.79,35.84 v32.82,35.81 | U2.1 v41.52,37.36 | D1.2 28.47,45.31 arc90 v28.57,45.41
  Top 0.406: v11.72,67.41 arc-90 11.7,67.39 IC2.4 v9.86,64.36 9.86,62.72 arc90 C29.1
  pour Route2: -2.78,88.76 84.92,88.76 84.92,48.16 84.92,-5.39 71.92,-5.39 -2.78,-5.39
5V  (via drill 0.35)
  Top 0.152: U3.20 16.14,5 arc90 18.68,2.46 40.23,2.46 arc90 42.77,5 J3.5V
  Top 0.406: J2.VBUS 16.86,69.98 arc-90 IC2.3 25.34,69.68 arc90 IC3.3 27.51,69.7 arc90 v27.57,69.76 | 62.43,20.85 arc90 v62.47,20.81 62.47,25.77 arc90 59.93,28.31 43.93,28.31 arc-90 U$6.P$11
  Bottom 0.406: v27.57,69.76 27.57,74.72 arc-90 30.11,77.26 71.22,77.26 arc-90 72.82,75.66 72.82,64.11 arc90 74.52,62.41 75.03,62.41 arc-90 77.57,59.87 77.57,23.35 arc-90 75.03,20.81 v62.47,20.81 51.76,20.81 arc90 49.22,18.27 49.22,17.56 arc-90 47.47,15.81 43.07,15.81 arc-90 J3.5V
A_FPGA  (via drill 0.35)
  Top 0.152: U1.60 18.19,32.99 arc-90 v16.87,34.31 | v52.57,40.56 52.62,40.56 arc90 53.22,41.16 arc-90 53.56,41.5 Q4.2
  Bottom 0.152: v16.87,34.31 29.07,34.31 arc90 30.52,35.76 30.52,36.41 arc-90 31.47,37.36 38.67,37.36 40.17,37.36 arc90 41.27,38.46 41.27,40.71 arc-90 42.37,41.81 51.32,41.81 arc-90 v52.57,40.56
B_FPGA  (via drill 0.35)
  Top 0.152: U1.63 19.54,34.49 arc-90 v18.27,35.76 | v52.72,43.61 arc90 53.17,44.06 53.17,44.26 arc-90 53.52,44.61 Q3.2
  Bottom 0.152: v18.27,35.76 27.37,35.76 arc90 28.77,37.16 28.77,37.81 arc-90 29.87,38.91 38.12,38.91 arc90 39.62,40.41 39.62,42.46 arc-90 40.52,43.36 52.47,43.36 arc90 v52.72,43.61
BLUE  (via drill 0.35)
  Top 0.152: R31.1 arc90 24.5,54.61 R35.1 arc-90 25.72,56.81 29.17,56.81 arc-90 30.07,55.91 30.07,54.71 arc-90 R32.1 29.29,53.24 arc90 R33.1 arc90 31.17,51.36 33.92,51.36 arc90 34.67,52.11 34.67,54.76 arc90 34.07,55.36 33.3,55.36 arc-90 R34.1 33.18,57.32 arc-90 v33.27,57.41
  Bottom 0.152: v33.27,57.41 33.27,59.76 arc-90 34.92,61.41 41.63,61.41 arc90 44.17,63.95 J1.3
BLUE0  (via drill 0.35)
  Top 0.152: U1.86 15.97,37.16 arc-90 v15.3,36.49 | v22.52,51.76 arc-90 22.99,52.23 R31.2
  Bottom 0.152: v15.3,36.49 arc90 15.47,36.66 15.47,45.76 arc-90 16.52,46.81 arc90 17.87,48.16 17.87,49.16 arc-90 19.17,50.46 21.22,50.46 arc90 v22.52,51.76
BLUE1  (via drill 0.35)
  Top 0.152: U1.83 17.47,37.31 arc90 v17.77,37.01 | v27.12,53.96 v27.12,53.97 arc-90 R32.2
  Bottom 0.152: v17.77,37.01 17.77,43.81 arc-90 18.32,44.36 arc90 19.37,45.41 19.37,47.61 arc-90 20.32,48.56 23.22,48.56 arc90 24.62,49.96 24.62,52.21 arc-90 25.47,53.06 26.22,53.06 arc90 v27.12,53.96
BLUE2  (via drill 0.35)
  Top 0.152: U1.82 17.97,38.17 arc90 v18.38,37.76 | v30.82,53.76 30.82,53.41 arc90 R33.2
  Bottom 0.152: v18.38,37.76 18.38,42.07 arc-90 19.22,42.91 arc90 20.02,43.71 20.02,46.61 arc-90 21.22,47.81 24.27,47.81 arc90 25.37,48.91 25.37,51.56 arc-90 26.02,52.21 29.27,52.21 arc90 v30.82,53.76
BLUE3  (via drill 0.35)
  Top 0.152: U1.81 18.47,38.98 arc90 v18.98,38.46 | v33.72,53.61 32.82,53.61 arc-90 R34.2
  Bottom 0.152: v18.98,38.46 18.98,41.68 arc-90 19.82,42.51 arc90 20.82,43.51 20.82,46.21 arc-90 21.67,47.06 24.87,47.06 arc90 26.17,48.36 26.17,51.06 arc-90 26.62,51.51 31.62,51.51 arc90 v33.72,53.61
BLUE4  (via drill 0.35)
  Top 0.152: U1.85 16.47,36.63 arc-90 v15.42,35.58 | v25.22,54.06 arc90 26.2,55.04 R35.2
  Bottom 0.152: v15.42,35.58 arc90 16.12,36.28 16.12,44.76 arc-90 17.27,45.91 arc90 18.62,47.26 18.62,48.51 arc-90 19.82,49.71 22.77,49.71 arc90 23.67,50.61 23.67,52.51 arc-90 v25.22,54.06
CLK_GB
  Top 0.152: U2.2 43.81,38 arc-90 46.35,35.46 U$6.P$14
CLK_GB_FPGA
  Top 0.152: U1.69 22.69,37.44 24.8,37.44 arc90 24.87,37.51 arc-90 25.07,37.71 25.77,37.71 arc-90 26.02,37.46 arc90 26.04,37.44 27.95,37.44 arc90 28.57,38.06 arc-90 29.16,38.66 U2.18
CLK_NES  (via drill 0.35)
  Top 0.152: v26.92,5.71 22,5.71 arc90 U3.2
  Bottom 0.152: v26.92,5.71 arc90 27.92,6.71 27.92,7.06 arc-90 30.02,9.16 39.62,9.16 arc90 40.72,10.26 40.72,17.56 arc-90 J3.CLOCK
CLK_NES_FPGA  (via drill 0.35)
  Top 0.152: U3.18 17.08,6.36 arc90 v19.24,8.51 | v15.9,32.55 arc-90 16.97,31.48 U1.42
  Bottom 0.152: v19.24,8.51 19.24,9.49 arc90 18.72,10.01 arc-90 16.42,12.31 16.42,32.03 arc90 v15.9,32.55
DATA0
  Top 0.152: U2.5 39.83,39.95 arc-90 40.32,39.46 arc90 40.72,39.06 47.03,39.06 arc-90 49.92,36.17 49.92,31.81 arc-90 48.87,30.76 48.62,30.76 arc90 U$6.P$15
DATA0_FPGA
  Top 0.152: U2.15 25.67,40.61 arc90 25.22,40.16 25.22,40.06 arc-90 24.67,39.51 22.66,39.51 arc90 U1.73
DATA1
  Top 0.152: U2.3 46.26,38.66 arc-90 48.8,36.12 U$6.P$16
DATA1_FPGA
  Top 0.152: U1.71 25.7,38.49 arc90 26.17,38.96 arc-90 26.52,39.32 U2.17
DATA_NES
  Top 0.152: U2.6 37.67,40.61 arc90 36.62,39.56 36.62,35.21 arc90 37.07,34.76 arc-90 37.52,34.31 37.52,31.56 arc-90 36.82,30.86 arc90 36.32,30.36 36.32,29.16 arc-90 34.92,27.76 28.06,27.76 arc90 27.37,27.07 27.37,24.41 arc90 28.42,23.36 32.2,23.36 arc-90 34.77,20.8 J3.DATA
DATA_NES_FPGA
  Top 0.152: U1.74 24.05,39.99 arc90 24.47,40.41 24.47,40.61 arc-90 25.02,41.16 32.7,41.16 arc90 U2.14
DOWN_FPGA  (via drill 0.35)
  Top 0.152: U1.66 22.18,35.99 arc-90 v20.31,37.86 | v57.82,52.26 arc90 57.17,51.61 57.17,51.11 arc-90 56.69,50.63 Q1.5
  Bottom 0.152: v20.31,37.86 arc90 20.81,37.36 23.12,37.36 arc90 25.07,39.31 25.07,41.11 arc-90 26.27,42.31 30.07,42.31 arc90 31.42,43.66 31.42,45.31 arc-90 32.62,46.51 55.28,46.51 arc90 57.82,49.05 v57.82,52.26
GND  (via drill 0.35)
  other vias: 35.22,42.56 27.17,38.66 35.22,40.91 56.52,60.31 61.27,60.46 56.52,56.11 61.12,56.11 69.37,49.76 73.47,49.86 69.47,45.51 73.52,45.71 13.62,30.01 18.82,31.11
  pour Top: -2.78,88.76 84.92,88.76 84.92,67.76 84.92,-5.44 79.67,-5.44 -2.78,-5.44
  pour Bottom: -2.78,88.76 84.92,88.76 84.92,-5.39 -2.78,-5.39
GREEN  (via drill 0.35)
  Top 0.152: R23.1 12.82,55.22 arc-90 R24.1 arc-90 14.46,56.86 15.75,56.86 arc-90 R26.1 arc90 15.91,54.5 R25.1 R27.1 arc-90 R27.1 19.72,53.89 arc90 R28.1 21.45,57.19 arc-90 v21.47,57.21
  Bottom 0.152: v21.47,57.21 21.47,60.37 arc-90 24.01,62.91 40.72,62.91 arc90 41.87,64.06 41.87,66.94 arc-90 J1.2
GREEN0  (via drill 0.35)
  Top 0.152: U1.94 11.97,41.56 arc-90 v11.22,40.81 | v12.08,51.06 12.08,51.44 arc-90 R23.2
  Bottom 0.152: v11.22,40.81 11.22,50.21 arc-90 v12.08,51.06
GREEN1  (via drill 0.35)
  Top 0.152: U1.93 12.47,41.05 arc-90 v11.32,39.9 | v14.32,54.01 arc90 14.9,54.59 R24.2
  Bottom 0.152: v11.32,39.9 arc90 11.97,40.55 11.97,49.61 arc-90 12.62,50.26 arc90 13.02,50.66 13.02,53.26 arc-90 13.72,53.96 14.27,53.96 arc90 v14.32,54.01
GREEN2  (via drill 0.35)
  Top 0.152: U1.91 13.47,40.77 arc-90 v12,39.3 | v14.32,51.66 arc-90 14.86,52.2 R25.2
  Bottom 0.152: v12,39.3 arc90 12.62,39.92 12.62,49.06 arc-90 13.22,49.66 arc90 14.32,50.76 v14.32,51.66
GREEN3  (via drill 0.35)
  Top 0.152: U1.90 13.97,39.81 arc-90 v13.23,39.06 | v19.92,55.56 18.75,55.56 arc-90 R26.2
  Bottom 0.152: v13.23,39.06 13.23,48.17 arc-90 14.12,49.06 arc90 15.37,50.31 15.37,54.36 arc-90 16.57,55.56 v19.92,55.56
GREEN4  (via drill 0.35)
  Top 0.152: U1.89 14.47,38.61 arc-90 v13.92,38.06 | v17.72,52.16 19.58,52.16 arc90 R27.2
  Bottom 0.152: v13.92,38.06 13.92,47.56 arc-90 14.67,48.31 arc90 16.22,49.86 16.22,50.71 arc-90 17.67,52.16 v17.72,52.16
GREEN5  (via drill 0.35)
  Top 0.152: U1.87 15.47,38.36 arc-90 v14.07,36.96 | v21.77,53.91 22.02,53.91 arc90 22.82,54.71 22.82,55.46 arc-90 22.98,55.62 R28.2
  Bottom 0.152: v14.07,36.96 14.37,36.96 arc90 14.87,37.46 14.87,46.76 arc-90 15.62,47.51 arc90 16.92,48.81 16.92,49.86 arc-90 18.27,51.21 20.52,51.21 arc90 21.72,52.41 21.72,53.86 arc-90 v21.77,53.91
HS  (via drill 0.35)
  Top 0.152: U1.79 19.47,40.55 arc90 v20.26,39.75 | v43.57,60.76 arc-90 43.71,60.62 R4.2
  Bottom 0.152: v20.26,39.75 arc-90 19.87,40.15 19.87,40.71 arc-90 20.37,41.21 arc90 22.32,43.16 22.32,44.01 arc-90 23.67,45.36 26.82,45.36 arc90 28.22,46.76 28.22,48.51 arc-90 29.12,49.41 33.13,49.41 arc90 35.67,51.95 35.67,54.56 arc-90 36.57,55.46 42.32,55.46 arc90 43.52,56.66 43.52,60.71 arc-90 v43.57,60.76
HSYNC  (via drill 0.35)
  Top 0.152: v42.22,41.06 arc90 42.03,41.25 U2.7
  Route15 0.152: U$6.P$17 50.05,33.08 arc90 48.97,34.16 43.57,34.16 arc-90 42.82,34.91 42.82,40.46 arc90 v42.22,41.06
HSYNC_FPGA  (via drill 0.35)
  Top 0.152: U2.13 34.17,41.91 arc90 v34.22,41.96 | v22.72,27.56 arc-90 22.64,27.64 U1.51
  Route15 0.152: v34.22,41.96 23.57,41.96 arc90 22.82,41.21 22.82,27.66 arc-90 v22.72,27.56
L_AUDIO
  Top 0.152: J4.4 65.2,55.53 arc90 R1.1 65.5,34.73 arc-90 62.96,32.19 U$6.P$20
LATCH_NES  (via drill 0.35)
  Top 0.152: v26.25,6.33 22.01,6.33 arc-90 U3.3
  Bottom 0.152: J3.LATCH arc90 36.77,17.61 36.77,11.06 arc-90 35.72,10.01 28.79,10.01 arc90 26.25,7.47 v26.25,6.33
LATCH_NES_FPGA  (via drill 0.35)
  Top 0.152: U3.17 16.83,7.02 arc90 v18.33,8.51 | v15.37,31.66 arc-90 16.47,30.56 U1.41
  Bottom 0.152: v18.33,8.51 18.33,8.8 arc90 17.62,9.51 arc-90 15.37,11.76 v15.37,31.66
LEFT_FPGA  (via drill 0.35)
  Top 0.152: U1.62 18.69,33.99 arc-90 v17.62,35.06 | v58.85,45.73 57.99,45.73 arc90 57.22,44.96 arc-90 56.87,44.61 Q3.5
  Bottom 0.152: v17.62,35.06 27.97,35.06 arc90 29.52,36.61 29.52,37.01 arc-90 30.67,38.16 39.17,38.16 arc90 40.42,39.41 40.42,41.66 arc-90 41.47,42.71 56.31,42.71 arc90 58.85,45.25 v58.85,45.73
N$1
  Top 0.152: U1.75 22.64,44.43 arc-90 D1.1
N$2
  Top 0.152: Q1.1 52.54,51.28 arc90 D7.A
N$3
  Top 0.152: R3.1 49.93,57.09 arc90 52.47,59.63 52.47,70.77 arc90 49.93,73.31 47.72,73.31 arc90 J1.14
N$4
  Top 0.152: R4.1 48.38,59.24 arc90 50.92,61.78 50.92,68.22 arc90 48.38,70.76 45.45,70.76 arc-90 J1.13
N$5
  Top 0.152: R1.2 arc-90 67.36,55.39 RIGHT_AUDIO.TP 72.2,73.7 arc-90 J4.1
N$6
  Top 0.152: U1.43 17.47,25.45 arc-90 R2.1
N$7
  Top 0.152: U1.44 17.97,21.19 arc-90 R5.1
N$8
  Top 0.152: R11.1 69.56,30.11 | 69.56,30.11 R12.2 arc-90 R12.2 69.57,31.53 arc-90 U$5.1 | 69.56,30.11
N$9
  Top 0.152: Q1.4 57.31,49.98 arc90 D4.A
N$10
  Top 0.152: Q2.1 52.72,48.27 arc90 D3.A
N$11
  Top 0.152: Q2.4 57.34,46.97 arc90 D8.A
N$13
  Top 0.152: U$5.7 72.55,37.13 arc90 73.12,36.56 arc-90 73.83,35.86 U$5.3 73.83,31.25 arc90 R15.2
N$14
  Top 0.152: D5.A arc-90 57.65,43.96 Q3.4
N$17
  Top 0.152: Q4.4 57.53,40.85 arc90 D9.A
N$18
  Top 0.152: Q4.1 52.48,42.15 arc90 D10.A
N$21
  Top 0.152: D6.A arc-90 52.53,45.26 Q3.1
OSC_OUT  (via drill 0.35)
  Top 0.152: U1.78 19.97,41.33 arc90 v20.93,40.37 | v36.92,49.86 38.38,49.86 arc90 Y1.3
  Bottom 0.152: v20.93,40.37 21.93,40.37 arc90 23.47,41.91 23.47,42.91 arc-90 24.77,44.21 27.97,44.21 arc90 29.47,45.71 29.47,47.66 arc-90 30.27,48.46 35.52,48.46 arc90 v36.92,49.86
P10  (via drill 0.35)
  Top 0.152: Q4.6 55.86,42.15 arc90 55.17,41.46 arc-90 54.56,40.85 Q4.3 arc90 54.02,40.69 v54.02,40.12
  Route2 0.152: U$6.P$8 arc-90 40.22,33.61 52.72,33.61 arc90 54.02,34.91 v54.02,40.12
P11  (via drill 0.35)
  Top 0.152: Q3.3 55.17,43.96 | Q3.6 55.82,45.26 arc90 55.17,44.61 55.17,43.96 | v55.17,43.32 55.17,43.96
  Route2 0.152: U$6.P$4 arc90 35.13,30.86 36.57,30.86 arc90 37.52,31.81 37.52,32.56 arc-90 39.17,34.21 50.73,34.21 arc90 53.27,36.75 53.27,41.42 arc-90 v55.17,43.32
P12  (via drill 0.35)
  Top 0.152: Q2.3 54.53,46.97 arc90 55.17,47.61 arc-90 55.83,48.27 Q2.6 arc90 56.67,48.76 v56.67,49.16
  Route2 0.152: U$6.P$7 arc-90 38.77,30.91 55.32,30.91 arc90 56.72,32.31 56.72,49.11 arc90 v56.67,49.16
P13  (via drill 0.35)
  Top 0.152: Q1.3 55.14,49.98 arc90 55.17,50.01 | Q1.6 55.84,51.28 arc90 55.17,50.61 55.17,50.01 | 55.17,50.01 55.17,49.01 v55.27,48.91
  Route2 0.152: U$6.P$6 36.3,32.37 arc-90 38.84,34.91 49.12,34.91 arc90 51.57,37.36 51.57,46.37 arc-90 54.11,48.91 v55.27,48.91
P14  (via drill 0.35)
  Top 0.152: D4.C 61.56,47.93 arc90 D8.C 61.61,44.64 arc90 D5.C 61.65,41.76 | 61.65,41.76 D9.C | U$6.P$5 35.05,34.74 arc-90 v35.17,34.86 | v61.72,40.21 61.72,41.69 arc90 61.65,41.76
  Bottom 0.152: v35.17,34.86 42.97,34.86 arc90 44.02,35.91 44.02,36.76 arc-90 44.72,37.46 59.18,37.46 arc90 61.72,40 v61.72,40.21
P15  (via drill 0.35)
  Top 0.152: D7.C arc-90 48.79,50.79 D3.C D6.C arc-90 D6.C D10.C arc-90 49.92,40.67 v49.92,38.51 | U$6.P$9 40.05,35.79 arc-90 v40.22,35.96
  Bottom 0.152: v40.22,35.96 42.21,35.96 arc90 43.42,37.16 43.42,37.51 arc-90 44.42,38.51 v49.92,38.51
PWR_SW  (via drill 0.35)
  Top 0.152: U3.16 16.56,7.65 arc90 v17.42,8.51 | v14.67,30.66 arc-90 15.97,29.36 U1.40
  Bottom 0.152: v17.42,8.51 17.21,8.51 arc-90 14.67,11.05 v14.67,30.66
RED  (via drill 0.35)
  Top 0.152: R19.1 5.14,53.68 arc-90 R16.1 arc-90 5.67,54.21 v7.32,54.21 | R18.1 8.06,53.42 arc-90 7.32,54.16 v7.32,54.21 | v7.32,54.21 7.32,55.91 arc-90 R14.1 arc90 7.59,56.51 6,56.51 arc-90 R17.1
  Bottom 0.152: v7.32,54.21 7.32,62.67 arc-90 9.86,65.21 38.37,65.21 arc90 39.6,66.44 J1.1
RED0
  Top 0.152: R14.2 9.69,55.14 arc-90 10.97,53.86 U1.96
RED1
  Top 0.152: R16.2 5.15,55.74 arc90 3.87,54.46 3.87,51.66 arc90 5.02,50.51 6.87,50.51 arc-90 8.97,48.41 U1.100
RED2
  Top 0.152: R17.2 8.93,57.43 arc-90 11.47,54.89 U1.95
RED3
  Top 0.152: R18.2 9.21,52.22 arc-90 10.47,50.96 U1.97
RED4
  Top 0.152: R19.2 arc90 8.46,50.71 8.52,50.71 arc-90 9.47,49.76 U1.99
RIGHT_FPGA  (via drill 0.35)
  Top 0.152: U1.59 17.34,32.49 arc-90 v16.57,33.26 | v58.06,42.63 57.99,42.63 arc90 57.27,41.91 arc-90 56.86,41.5 Q4.5
  Bottom 0.152: v16.57,33.26 16.92,33.61 30.02,33.61 arc90 31.47,35.06 31.47,35.81 arc-90 32.22,36.56 41.12,36.56 arc90 42.37,37.81 arc-90 44.07,39.51 55.52,39.51 arc90 58.06,42.05 v58.06,42.63
SCK_PROG  (via drill 0.35)
  Top 0.152: U1.48 19.97,28.67 arc-90 v20.39,29.09 | v74.22,38.26 arc-90 73.83,38.66 U$5.6
  Bottom 0.152: v20.39,29.09 arc-90 22.41,31.11 63.72,31.11 arc90 65.97,33.36 65.97,35.67 arc-90 68.51,38.21 74.17,38.21 arc90 v74.22,38.26
SDI_PROG  (via drill 0.35)
  Top 0.152: U1.46 v18.97,24.01 | v72.62,30.31 arc-90 72.55,30.38 U$5.2
  Bottom 0.152: v18.97,24.01 arc90 19.67,23.31 70.08,23.31 arc90 72.62,25.85 v72.62,30.31
SDO_PROG  (via drill 0.35)
  Top 0.152: U1.45 18.47,29.01 arc90 v18.17,29.31 | v74.22,37.31 arc90 75.09,38.19 U$5.5
  Bottom 0.152: v18.17,29.31 18.17,23.91 arc90 19.37,22.71 71.68,22.71 arc90 74.22,25.25 v74.22,37.31
SELECT_FPGA  (via drill 0.35)
  Top 0.152: U1.65 21.51,35.49 arc-90 v19.4,37.6 | v53.02,45.91 53.02,46.46 arc-90 Q2.2
  Bottom 0.152: v19.4,37.6 arc90 20.09,36.91 23.52,36.91 arc90 25.92,39.31 25.92,40.46 arc-90 26.87,41.41 30.87,41.41 arc90 32.47,43.01 32.47,44.51 arc-90 33.67,45.71 52.83,45.71 arc90 v53.02,45.91
SS_PROG  (via drill 0.35)
  Top 0.152: R12.1 66.43,31.12 arc90 v66.22,30.91 | v20.92,28.21 arc90 20.47,27.76 U1.49
  Bottom 0.152: v66.22,30.91 66.07,30.76 23.31,30.76 arc90 20.92,28.37 v20.92,28.21
START_FPGA  (via drill 0.35)
  Top 0.152: U1.68 22.34,36.99 arc-90 v21.22,38.11 | v52.52,49.26 arc90 53.12,49.86 53.12,50.06 arc-90 53.69,50.63 Q1.2
  Bottom 0.152: v21.22,38.11 23.12,38.11 arc90 24.22,39.21 24.22,41.86 arc-90 25.47,43.11 29.22,43.11 arc90 30.47,44.36 30.47,46.06 arc-90 31.67,47.26 50.52,47.26 arc90 v52.52,49.26
UP_FPGA  (via drill 0.35)
  Top 0.152: U1.64 20.44,34.99 arc-90 v18.72,36.71 | v58.43,49.21 58.22,49.21 arc90 57.17,48.16 arc-90 56.63,47.62 Q2.5
  Bottom 0.152: v18.72,36.71 arc90 19.02,36.41 26.27,36.41 arc90 27.87,38.01 27.87,38.51 arc-90 29.17,39.81 36.92,39.81 arc90 38.67,41.56 38.67,43.11 arc-90 39.82,44.26 55.89,44.26 arc90 58.43,46.8 v58.43,49.21
VS  (via drill 0.35)
  Top 0.152: U1.80 18.97,39.76 arc90 v19.59,39.14 | v42.22,56.91 arc-90 42.4,57.09 R3.2
  Bottom 0.152: v19.59,39.14 arc-90 19.42,39.31 19.42,41.46 arc-90 19.77,41.81 19.82,41.81 arc90 21.57,43.56 21.57,45.01 arc-90 22.72,46.16 25.57,46.16 arc90 27.22,47.81 27.22,49.66 arc-90 28.02,50.46 32.72,50.46 arc90 34.67,52.41 34.67,55.76 arc-90 35.67,56.76 42.07,56.76 arc90 v42.22,56.91
VSYNC_FPGA
  Top 0.152: U2.16 26.21,39.95 arc90 25.72,39.46 arc-90 25.25,38.99 U1.72
VYSNC
  Top 0.152: U2.4 37.62,39.32 arc90 37.17,38.86 37.17,37.16 arc90 37.72,36.61 42.67,36.61 arc-90 43.72,35.56 43.72,32.27 arc90 U$6.P$12

### Text on the board
tPlace: Pro Sound | Remove | Right Audio
bPlace: v2